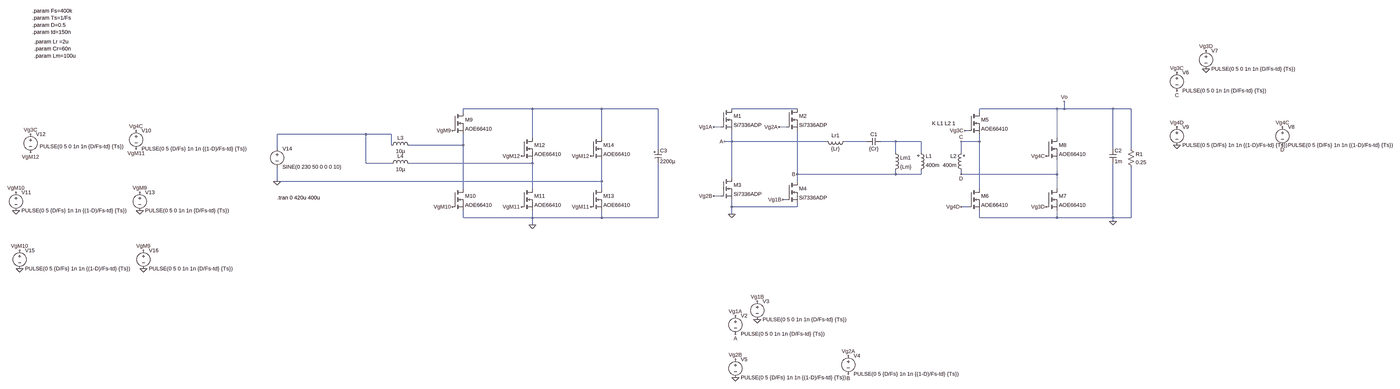
[diagram p0: schematic OBC.asc, whole sheet]
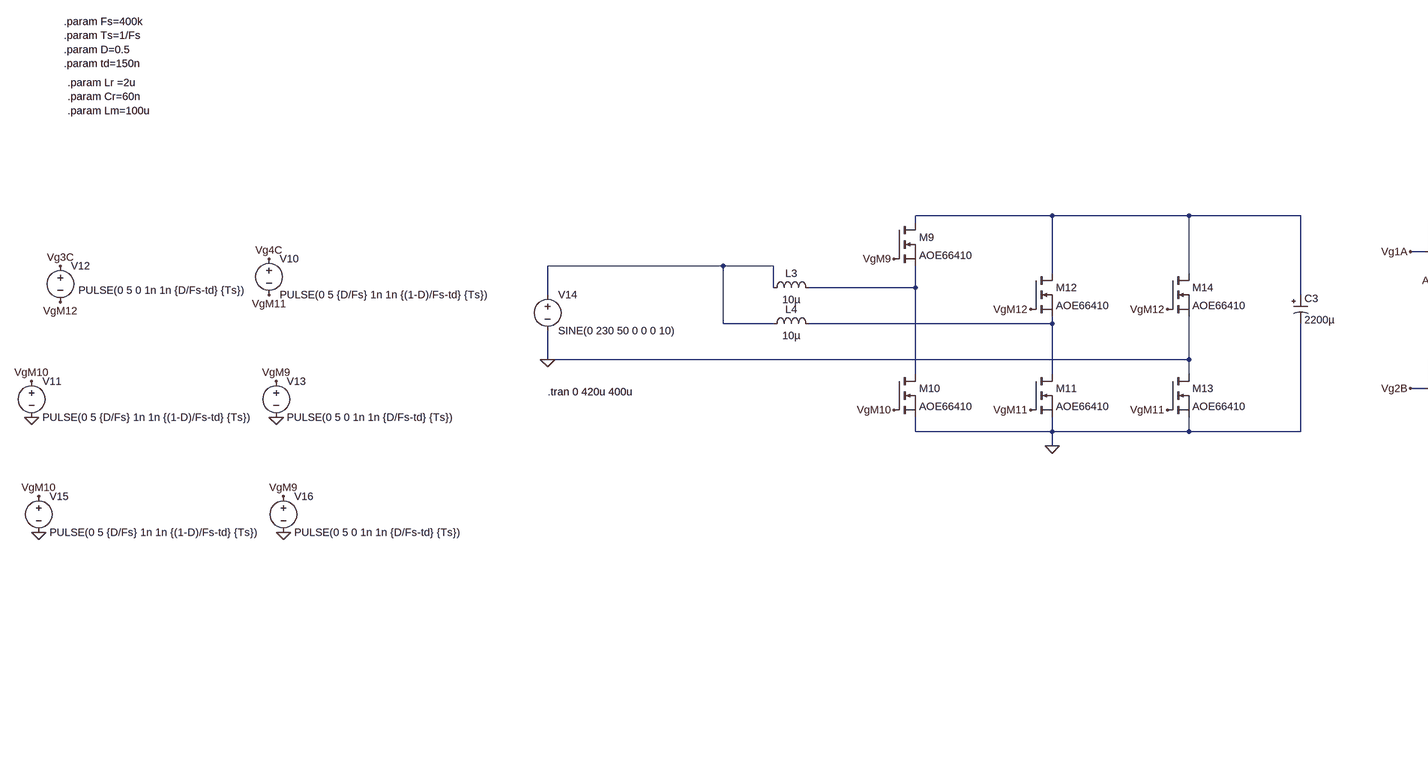
[diagram p1: schematic OBC.asc, part, row 1 of 1, column 1 of 2]
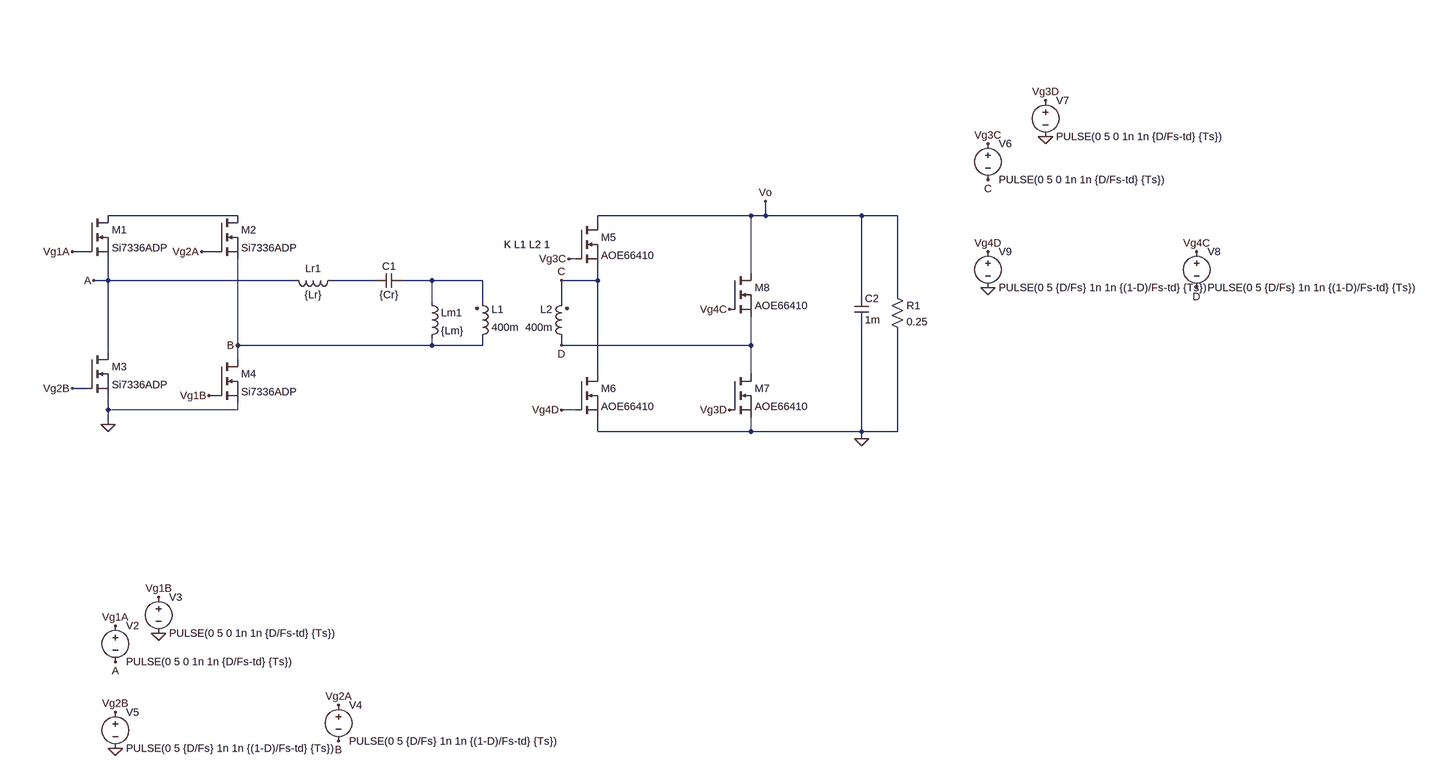
[diagram p2: schematic OBC.asc, part, row 1 of 1, column 2 of 2]
OBC.asc, the LTspice schematic file:
Version 4
SHEET 1 3196 1280
WIRE -1520 48 -1824 48
WIRE -1216 48 -1520 48
WIRE -864 48 -1216 48
WIRE 64 48 -224 48
WIRE 1552 48 864 48
WIRE 1584 48 1584 16
WIRE 1584 48 1552 48
WIRE 1824 48 1584 48
WIRE 1904 48 1824 48
WIRE -1824 64 -1824 48
WIRE 864 64 864 48
WIRE -272 128 -304 128
WIRE 16 128 -16 128
WIRE 816 144 800 144
WIRE -2320 160 -2752 160
WIRE -2160 160 -2320 160
WIRE -1520 176 -1520 48
WIRE -1216 176 -1216 48
WIRE 1552 176 1552 48
WIRE -224 192 -224 144
WIRE -224 192 -256 192
WIRE 192 192 -224 192
WIRE 368 192 272 192
WIRE 496 192 432 192
WIRE 608 192 496 192
WIRE 864 192 864 160
WIRE 864 192 784 192
WIRE -2160 208 -2160 160
WIRE -1824 208 -1824 160
WIRE -1824 208 -2080 208
WIRE -2752 224 -2752 160
WIRE -864 224 -864 48
WIRE 1824 224 1824 48
WIRE 1904 224 1904 48
WIRE 496 240 496 192
WIRE 608 240 608 192
WIRE 784 240 784 192
WIRE -2320 288 -2320 160
WIRE -2160 288 -2320 288
WIRE -1520 288 -1520 272
WIRE -1520 288 -2080 288
WIRE 64 336 64 144
WIRE 496 336 496 320
WIRE 496 336 64 336
WIRE 608 336 608 320
WIRE 608 336 496 336
WIRE 784 336 784 320
WIRE 1552 336 1552 272
WIRE 1552 336 784 336
WIRE -224 352 -224 192
WIRE -2752 368 -2752 304
WIRE -1216 368 -1216 272
WIRE -1216 368 -2752 368
WIRE 64 368 64 336
WIRE -1824 400 -1824 208
WIRE -1520 400 -1520 288
WIRE -1216 400 -1216 368
WIRE 864 400 864 192
WIRE 1552 400 1552 336
WIRE -272 432 -304 432
WIRE 16 448 0 448
WIRE -224 480 -224 448
WIRE 64 480 64 464
WIRE 64 480 -224 480
WIRE 816 480 784 480
WIRE -224 512 -224 480
WIRE -1824 528 -1824 496
WIRE -1520 528 -1520 496
WIRE -1520 528 -1824 528
WIRE -1216 528 -1216 496
WIRE -1216 528 -1520 528
WIRE -864 528 -864 288
WIRE -864 528 -1216 528
WIRE 864 528 864 496
WIRE 1552 528 1552 496
WIRE 1552 528 864 528
WIRE 1824 528 1824 288
WIRE 1824 528 1552 528
WIRE 1904 528 1904 304
WIRE 1904 528 1824 528
WIRE 1824 544 1824 528
WIRE -1520 560 -1520 528
FLAG 1584 16 Vo
FLAG 1824 544 0
FLAG -256 192 A
FLAG 64 336 B
FLAG -304 128 Vg1A
FLAG 0 448 Vg1B
FLAG -16 128 Vg2A
FLAG -304 432 Vg2B
FLAG -224 512 0
FLAG -208 960 Vg1A
FLAG -208 1040 A
FLAG -112 896 Vg1B
FLAG -112 976 0
FLAG 288 1136 Vg2A
FLAG 288 1216 B
FLAG -208 1152 Vg2B
FLAG -208 1232 0
FLAG 784 192 C
FLAG 784 336 D
FLAG 800 144 Vg3C
FLAG 1504 480 Vg3D
FLAG 1504 256 Vg4C
FLAG 784 480 Vg4D
FLAG 2240 -112 Vg3C
FLAG 2240 -32 C
FLAG 2368 -128 0
FLAG 2368 -208 Vg3D
FLAG 2704 128 Vg4C
FLAG 2704 208 D
FLAG 2240 208 0
FLAG 2240 128 Vg4D
FLAG -1568 480 VgM11
FLAG -1568 256 VgM12
FLAG -3488 144 Vg4C
FLAG -4016 496 0
FLAG -4016 416 VgM10
FLAG -3952 160 Vg3C
FLAG -3472 496 0
FLAG -3472 416 VgM9
FLAG -3952 240 VgM12
FLAG -3488 224 VgM11
FLAG -1872 144 VgM9
FLAG -1872 480 VgM10
FLAG -1264 480 VgM11
FLAG -1264 256 VgM12
FLAG -4000 752 0
FLAG -4000 672 VgM10
FLAG -3456 752 0
FLAG -3456 672 VgM9
FLAG -1520 560 0
FLAG -2752 368 0
SYMBOL nmos -272 48 R0
SYMATTR InstName M1
SYMATTR Value Si7336ADP
SYMBOL nmos 16 48 R0
SYMATTR InstName M2
SYMATTR Value Si7336ADP
SYMBOL ind 288 176 R90
WINDOW 0 5 56 VBottom 2
WINDOW 3 32 56 VTop 2
SYMATTR InstName Lr1
SYMATTR Value {Lr}
SYMBOL cap 432 176 R90
WINDOW 0 0 32 VBottom 2
WINDOW 3 32 32 VTop 2
SYMATTR InstName C1
SYMATTR Value {Cr}
SYMBOL ind 480 224 R0
SYMATTR InstName Lm1
SYMATTR Value {Lm}
SYMBOL ind2 592 336 M180
WINDOW 0 36 80 Left 2
WINDOW 3 36 40 Left 2
SYMATTR InstName L1
SYMATTR Value 400m
SYMATTR Type ind
SYMBOL ind2 800 336 R180
WINDOW 0 36 80 Left 2
WINDOW 3 36 40 Left 2
SYMATTR InstName L2
SYMATTR Value 400m
SYMATTR Type ind
SYMBOL nmos -272 352 R0
SYMATTR InstName M3
SYMATTR Value Si7336ADP
SYMBOL nmos 16 368 R0
SYMATTR InstName M4
SYMATTR Value Si7336ADP
SYMBOL cap 1808 224 R0
SYMATTR InstName C2
SYMATTR Value 1m
SYMBOL res 1888 208 R0
SYMATTR InstName R1
SYMATTR Value 0.25
SYMBOL voltage -208 944 R0
WINDOW 123 0 0 Left 0
WINDOW 39 0 0 Left 0
SYMATTR InstName V2
SYMATTR Value PULSE(0 5 0 1n 1n {D/Fs-td} {Ts})
SYMBOL voltage -112 880 R0
WINDOW 123 0 0 Left 0
WINDOW 39 0 0 Left 0
SYMATTR InstName V3
SYMATTR Value PULSE(0 5 0 1n 1n {D/Fs-td} {Ts})
SYMBOL voltage 288 1120 R0
WINDOW 123 0 0 Left 0
WINDOW 39 0 0 Left 0
SYMATTR InstName V4
SYMATTR Value PULSE(0 5 {D/Fs} 1n 1n {(1-D)/Fs-td} {Ts})
SYMBOL voltage -208 1136 R0
WINDOW 123 0 0 Left 0
WINDOW 39 0 0 Left 0
SYMATTR InstName V5
SYMATTR Value PULSE(0 5 {D/Fs} 1n 1n {(1-D)/Fs-td} {Ts})
SYMBOL nmos 816 64 R0
SYMATTR InstName M5
SYMATTR Value AOE66410
SYMBOL nmos 816 400 R0
SYMATTR InstName M6
SYMATTR Value AOE66410
SYMBOL nmos 1504 400 R0
SYMATTR InstName M7
SYMATTR Value AOE66410
SYMBOL nmos 1504 176 R0
SYMATTR InstName M8
SYMATTR Value AOE66410
SYMBOL voltage 2240 -128 R0
WINDOW 123 0 0 Left 0
WINDOW 39 0 0 Left 0
SYMATTR InstName V6
SYMATTR Value PULSE(0 5 0 1n 1n {D/Fs-td} {Ts})
SYMBOL voltage 2368 -224 R0
WINDOW 123 0 0 Left 0
WINDOW 39 0 0 Left 0
SYMATTR InstName V7
SYMATTR Value PULSE(0 5 0 1n 1n {D/Fs-td} {Ts})
SYMBOL voltage 2704 112 R0
WINDOW 123 0 0 Left 0
WINDOW 39 0 0 Left 0
SYMATTR InstName V8
SYMATTR Value PULSE(0 5 {D/Fs} 1n 1n {(1-D)/Fs-td} {Ts})
SYMBOL voltage 2240 112 R0
WINDOW 123 0 0 Left 0
WINDOW 39 0 0 Left 0
SYMATTR InstName V9
SYMATTR Value PULSE(0 5 {D/Fs} 1n 1n {(1-D)/Fs-td} {Ts})
SYMBOL nmos -1872 64 R0
SYMATTR InstName M9
SYMATTR Value AOE66410
SYMBOL nmos -1872 400 R0
SYMATTR InstName M10
SYMATTR Value AOE66410
SYMBOL nmos -1568 400 R0
SYMATTR InstName M11
SYMATTR Value AOE66410
SYMBOL nmos -1568 176 R0
SYMATTR InstName M12
SYMATTR Value AOE66410
SYMBOL voltage -3488 128 R0
WINDOW 123 0 0 Left 0
WINDOW 39 0 0 Left 0
SYMATTR InstName V10
SYMATTR Value PULSE(0 5 {D/Fs} 1n 1n {(1-D)/Fs-td} {Ts})
SYMBOL voltage -4016 400 R0
WINDOW 123 0 0 Left 0
WINDOW 39 0 0 Left 0
SYMATTR InstName V11
SYMATTR Value PULSE(0 5 {D/Fs} 1n 1n {(1-D)/Fs-td} {Ts})
SYMBOL voltage -3952 144 R0
WINDOW 123 0 0 Left 0
WINDOW 39 0 0 Left 0
WINDOW 3 40 70 Left 2
SYMATTR Value PULSE(0 5 0 1n 1n {D/Fs-td} {Ts})
SYMATTR InstName V12
SYMBOL voltage -3472 400 R0
WINDOW 123 0 0 Left 0
WINDOW 39 0 0 Left 0
SYMATTR InstName V13
SYMATTR Value PULSE(0 5 0 1n 1n {D/Fs-td} {Ts})
SYMBOL voltage -2752 208 R0
WINDOW 123 0 0 Left 0
WINDOW 39 0 0 Left 0
SYMATTR InstName V14
SYMATTR Value SINE(0 230 50 0 0 0 10)
SYMBOL ind -2176 224 R270
WINDOW 0 32 56 VTop 2
WINDOW 3 5 56 VBottom 2
SYMATTR InstName L3
SYMATTR Value 10µ
SYMATTR SpiceLine Ipk=1.4 Rser=0.127 Rpar=16970 Cpar=1.698p mfg="Bourns, Inc." pn="SDE0403A-100M"
SYMBOL ind -2176 304 R270
WINDOW 0 32 56 VTop 2
WINDOW 3 5 56 VBottom 2
SYMATTR InstName L4
SYMATTR Value 10µ
SYMATTR SpiceLine Ipk=1.4 Rser=0.127 Rpar=16970 Cpar=1.698p mfg="Bourns, Inc." pn="SDE0403A-100M"
SYMBOL nmos -1264 400 R0
SYMATTR InstName M13
SYMATTR Value AOE66410
SYMBOL nmos -1264 176 R0
SYMATTR InstName M14
SYMATTR Value AOE66410
SYMBOL voltage -4000 656 R0
WINDOW 123 0 0 Left 0
WINDOW 39 0 0 Left 0
SYMATTR InstName V15
SYMATTR Value PULSE(0 5 {D/Fs} 1n 1n {(1-D)/Fs-td} {Ts})
SYMBOL voltage -3456 656 R0
WINDOW 123 0 0 Left 0
WINDOW 39 0 0 Left 0
SYMATTR InstName V16
SYMATTR Value PULSE(0 5 0 1n 1n {D/Fs-td} {Ts})
SYMBOL polcap -880 224 R0
WINDOW 3 24 56 Left 2
SYMATTR Value 2200µ
SYMATTR InstName C3
SYMATTR Description Capacitor
SYMATTR Type cap
SYMATTR SpiceLine V=10 Irms=1.69 Rser=0.034 Lser=0 mfg="Chemi-Con" pn="LXF10VB222M12X25LL" type="Al electrolytic"
TEXT -3936 -248 Left 2 !.param Lr =2u\n.param Cr=60n\n.param Lm=100u
TEXT -3944 -384 Left 2 !.param Fs=400k\n.param Ts=1/Fs\n.param D=0.5\n.param td=150n
TEXT -2752 440 Left 2 !.tran 0 420u 400u
TEXT 656 112 Left 2 !K L1 L2 1

The netlist it stands for:
* OBC.asc
M1 N002 Vg1A A A Si7336ADP
M2 N002 Vg2A B B Si7336ADP
Lr1 N004 A {Lr}
C1 N005 N004 {Cr}
Lm1 N005 B {Lm}
L1 B N005 400m
L2 D C 400m
M3 A Vg2B 0 0 Si7336ADP
M4 B Vg1B 0 0 Si7336ADP
C2 Vo 0 1m
R1 Vo 0 0.25
V2 Vg1A A PULSE(0 5 0 1n 1n {D/Fs-td} {Ts})
V3 Vg1B 0 PULSE(0 5 0 1n 1n {D/Fs-td} {Ts})
V4 Vg2A B PULSE(0 5 {D/Fs} 1n 1n {(1-D)/Fs-td} {Ts})
V5 Vg2B 0 PULSE(0 5 {D/Fs} 1n 1n {(1-D)/Fs-td} {Ts})
M5 Vo Vg3C C C AOE66410
M6 C Vg4D 0 0 AOE66410
M7 D Vg3D 0 0 AOE66410
M8 Vo Vg4C D D AOE66410
V6 Vg3C C PULSE(0 5 0 1n 1n {D/Fs-td} {Ts})
V7 Vg3D 0 PULSE(0 5 0 1n 1n {D/Fs-td} {Ts})
V8 Vg4C D PULSE(0 5 {D/Fs} 1n 1n {(1-D)/Fs-td} {Ts})
V9 Vg4D 0 PULSE(0 5 {D/Fs} 1n 1n {(1-D)/Fs-td} {Ts})
M9 N001 VgM9 N006 N006 AOE66410
M10 N006 VgM10 0 0 AOE66410
M11 N007 VgM11 0 0 AOE66410
M12 N001 VgM12 N007 N007 AOE66410
V10 Vg4C VgM11 PULSE(0 5 {D/Fs} 1n 1n {(1-D)/Fs-td} {Ts})
V11 VgM10 0 PULSE(0 5 {D/Fs} 1n 1n {(1-D)/Fs-td} {Ts})
V12 Vg3C VgM12 PULSE(0 5 0 1n 1n {D/Fs-td} {Ts})
V13 VgM9 0 PULSE(0 5 0 1n 1n {D/Fs-td} {Ts})
V14 N003 0 SINE(0 230 50 0 0 0 10)
L3 N003 N006 10µ Ipk=1.4 Rser=0.127 Rpar=16970 Cpar=1.698p mfg="Bourns, Inc." pn="SDE0403A-100M"
L4 N003 N007 10µ Ipk=1.4 Rser=0.127 Rpar=16970 Cpar=1.698p mfg="Bourns, Inc." pn="SDE0403A-100M"
M13 0 VgM11 0 0 AOE66410
M14 N001 VgM12 0 0 AOE66410
V15 VgM10 0 PULSE(0 5 {D/Fs} 1n 1n {(1-D)/Fs-td} {Ts})
V16 VgM9 0 PULSE(0 5 0 1n 1n {D/Fs-td} {Ts})
C3 N001 0 2200µ V=10 Irms=1.69 Rser=0.034 Lser=0 mfg="Chemi-Con" pn="LXF10VB222M12X25LL" type="Al electrolytic"
.model NMOS NMOS
.model PMOS PMOS
.lib standard.mos
.param Lr =2u
.param Cr=60n
.param Lm=100u
.param Fs=400k
.param Ts=1/Fs
.param D=0.5
.param td=150n
.tran 0 420u 400u
K L1 L2 1
.backanno
.end